# EasyEDA schematic schematic.json
TITLE: Sheet_1; REV: 1.0; Date: 2024-07-22; Sheet: 1/1; Drawn By: somebud; Company: Your Company
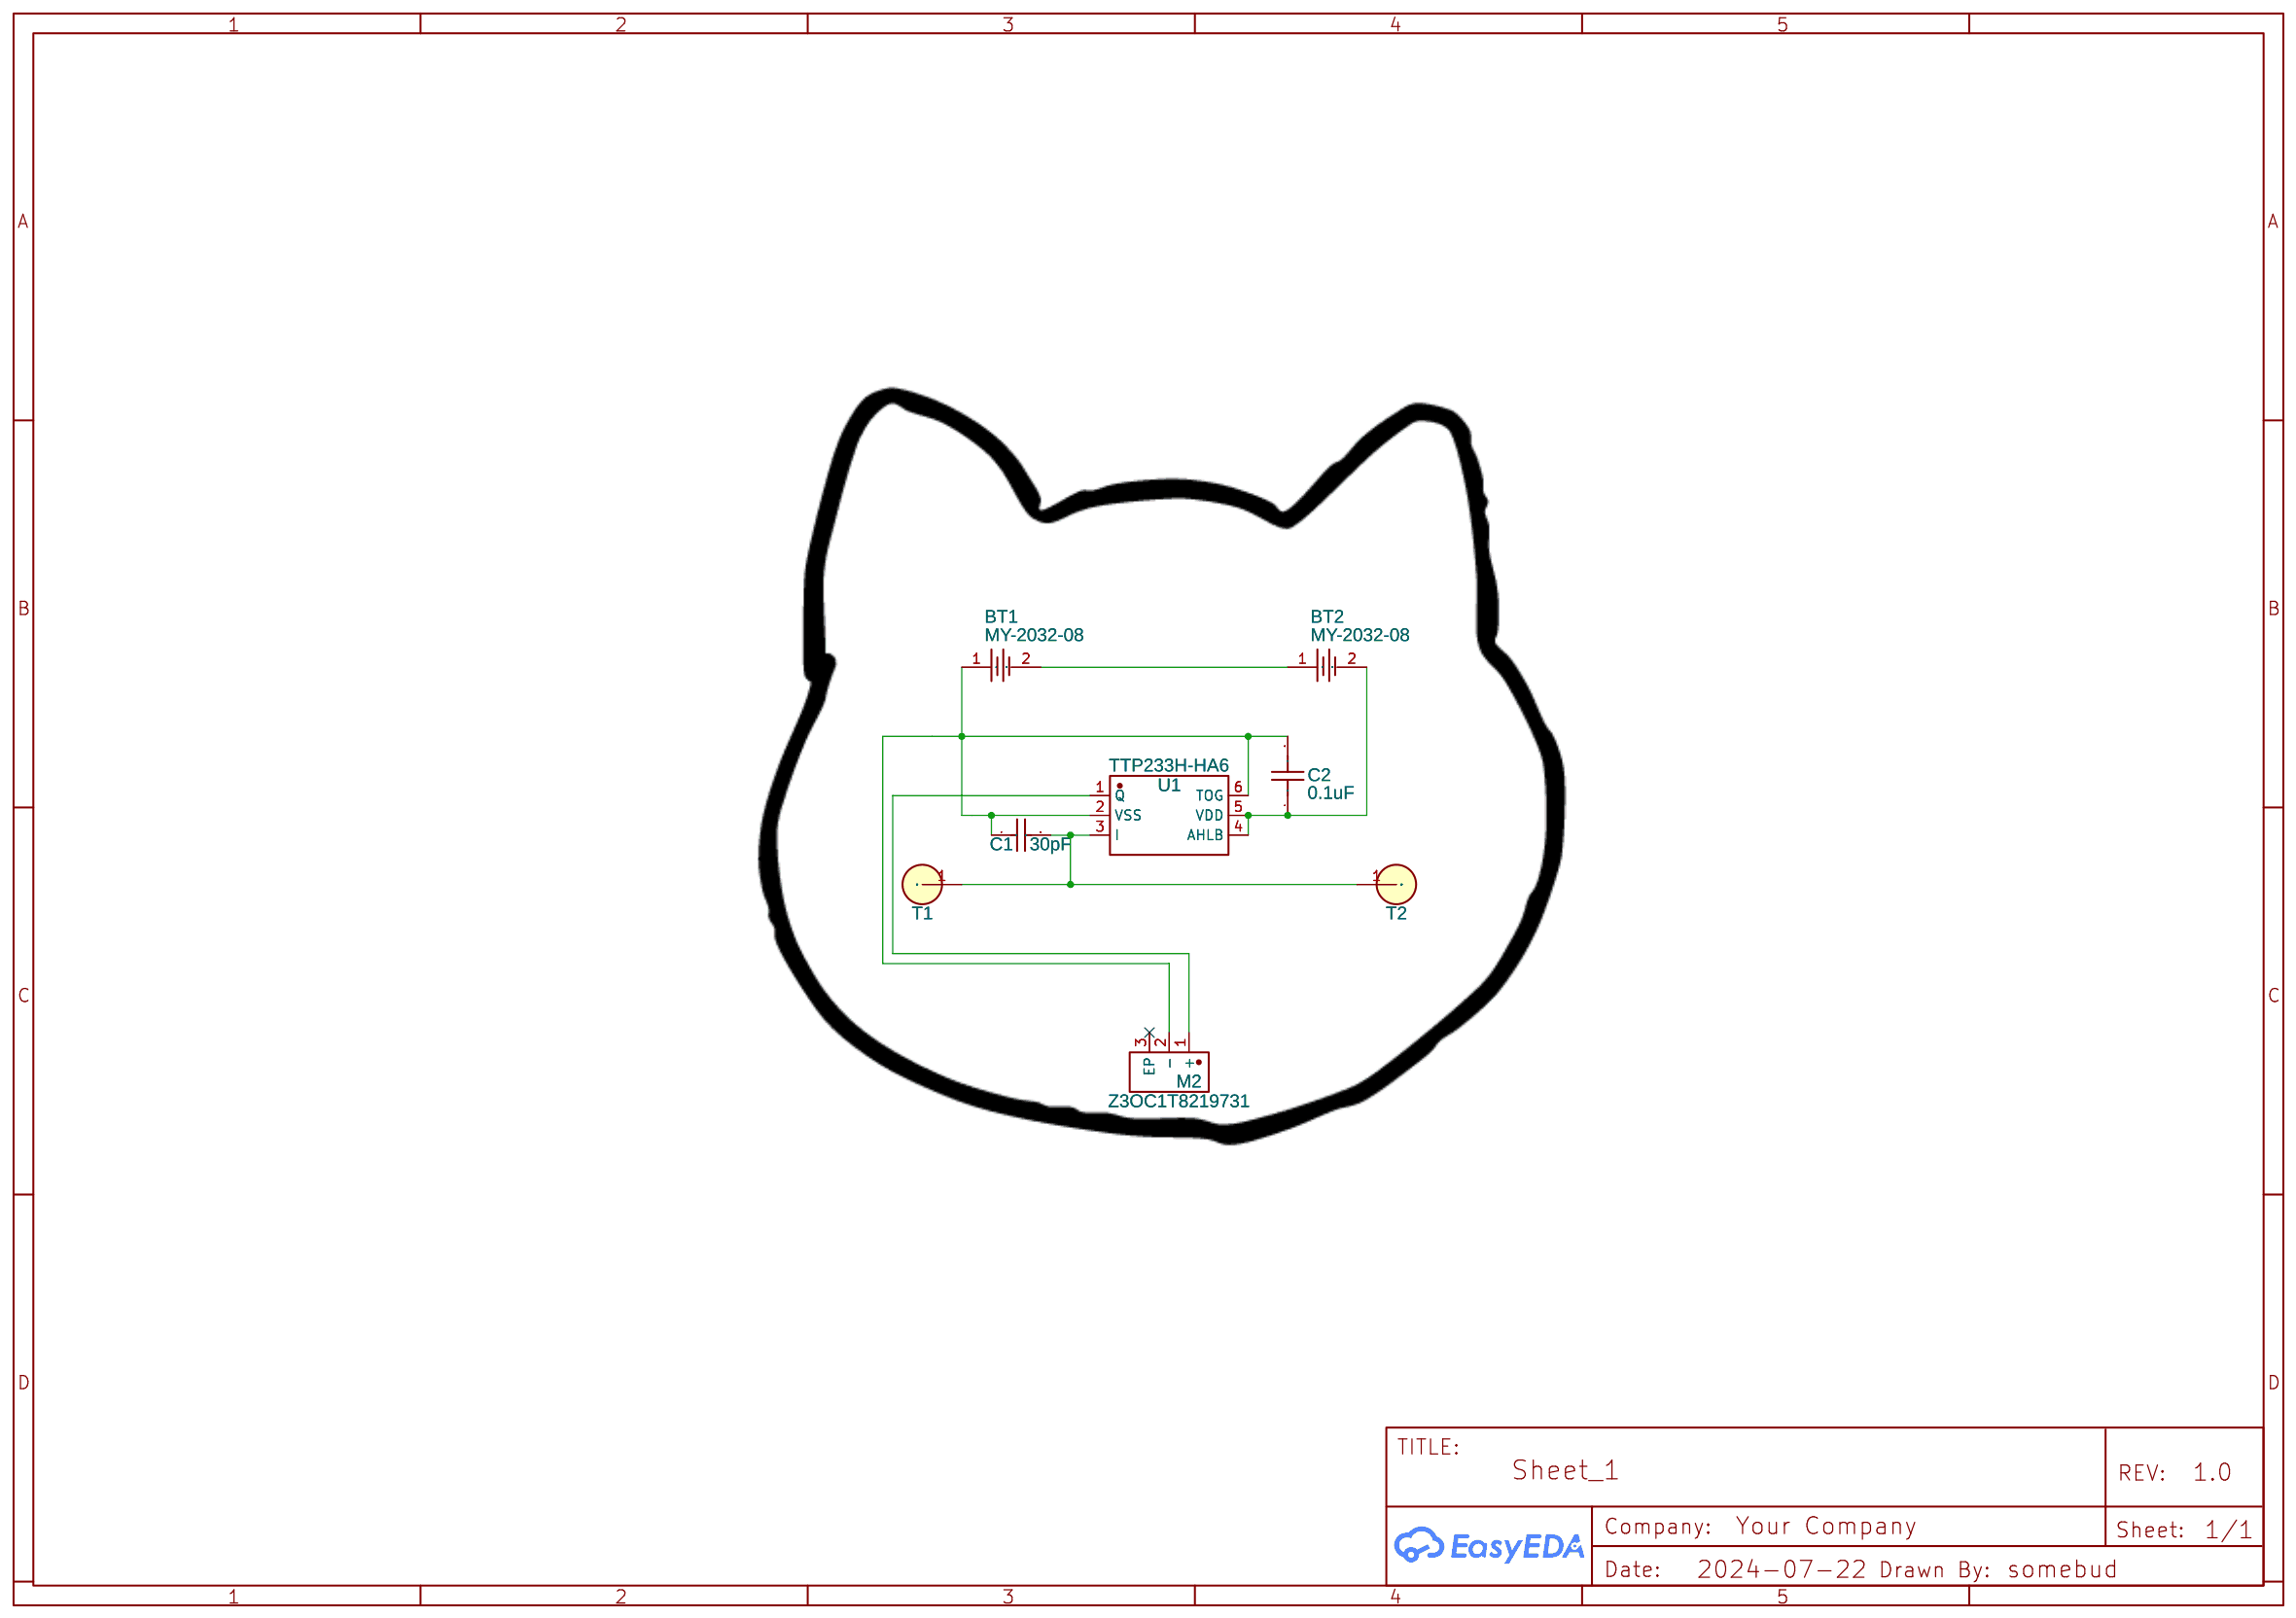
[diagram p0: schematic sheet]

## Parts
BT1  MY-2032-08  [BAT-SMD_MY-2032-08]
BT2  MY-2032-08  [BAT-SMD_MY-2032-08]
C1  30pF  [C0603]
C2  0.1uF  [C0603]
M2  Z3OC1T8219731  [VIBRATING-MOTOR-SMD_3P-C9900001680]
T1  TOUCHPAD 12mm circle nopaste nomask  [TOUCHPAD 12MM CIRCLE NOPASTE NOMASK]
T2  TOUCHPAD 12mm circle nopaste nomask  [TOUCHPAD 12MM CIRCLE NOPASTE NOMASK]
U1  TTP233H-HA6  [SOT-23-6_L2.9-W1.6-P0.95-LS2.8-BL]

## Library data of the parts
BT1 BT2 = MY-2032-08: Contributor: LCSC; Supplier: LCSC; Supplier Part: C964831; Manufacturer: MYOUNG(美阳); JLCPCB Part Class: Extended Part
C1 = 0603CG300J500NT: Supplier: LCSC; Manufacturer: FH(风华); Supplier Part: C1658; JLCPCB Part Class: Basic Part
C2 = C_0603_US: Contributor: LCEDA_Lib
M2 = Z3OC1T8219731: Contributor: LCSC; Supplier: LCSC; Supplier Part: C2894731; Manufacturer: KOTL(金龙机电); JLCPCB Part Class: Extended Part
T1 T2 = TOUCHPAD 12mm circle nopaste nomask: Contributor: extras2765
U1 = TTP233H-HA6: Contributor: LCSC; Supplier: LCSC; Supplier Part: C2835626; Manufacturer: TONTEK(通泰); JLCPCB Part Class: Extended Part

## Nets
Net-(BT1-1): BT1.1 C1.1 C2.2 M2.2(-) U1.2(VSS) U1.6(TOG)
Net-(BT1-2): BT1.2 BT2.1
Net-(BT2-2): BT2.2 C2.1 U1.4(AHLB) U1.5(VDD)
Net-(C1-2): C1.2 T1.1(Touch) T2.1(Touch) U1.3(I)
Net-(M2-1): M2.1(+) U1.1(Q)

Not connected (* = marked no-connect by the designer): M2 3(EP)*
